# Altium schematic sheet FrontEnd.SchDoc: Title
size 420 x 297 mm; CheckedBy: -; CompanyName: CERN; DrawnBy: DrawnBy; Organization: CERN; Address1: European Organization for Nuclear Research; Address2: CH-1211 Genčve 23 - Switzerland; DocumentNumber: 2; Revision: -; SheetNumber: 2; SheetTotal: 10; EDA_Number: EDA-XXXXX-VX-X; Projet: -; ModifiedBy: -; CreateDate: XX/XX/XXXX; CheckedDate: -; Title2: Title2; DivGrp: TE/MPE; Designer: Designer; ModifiedDate: -
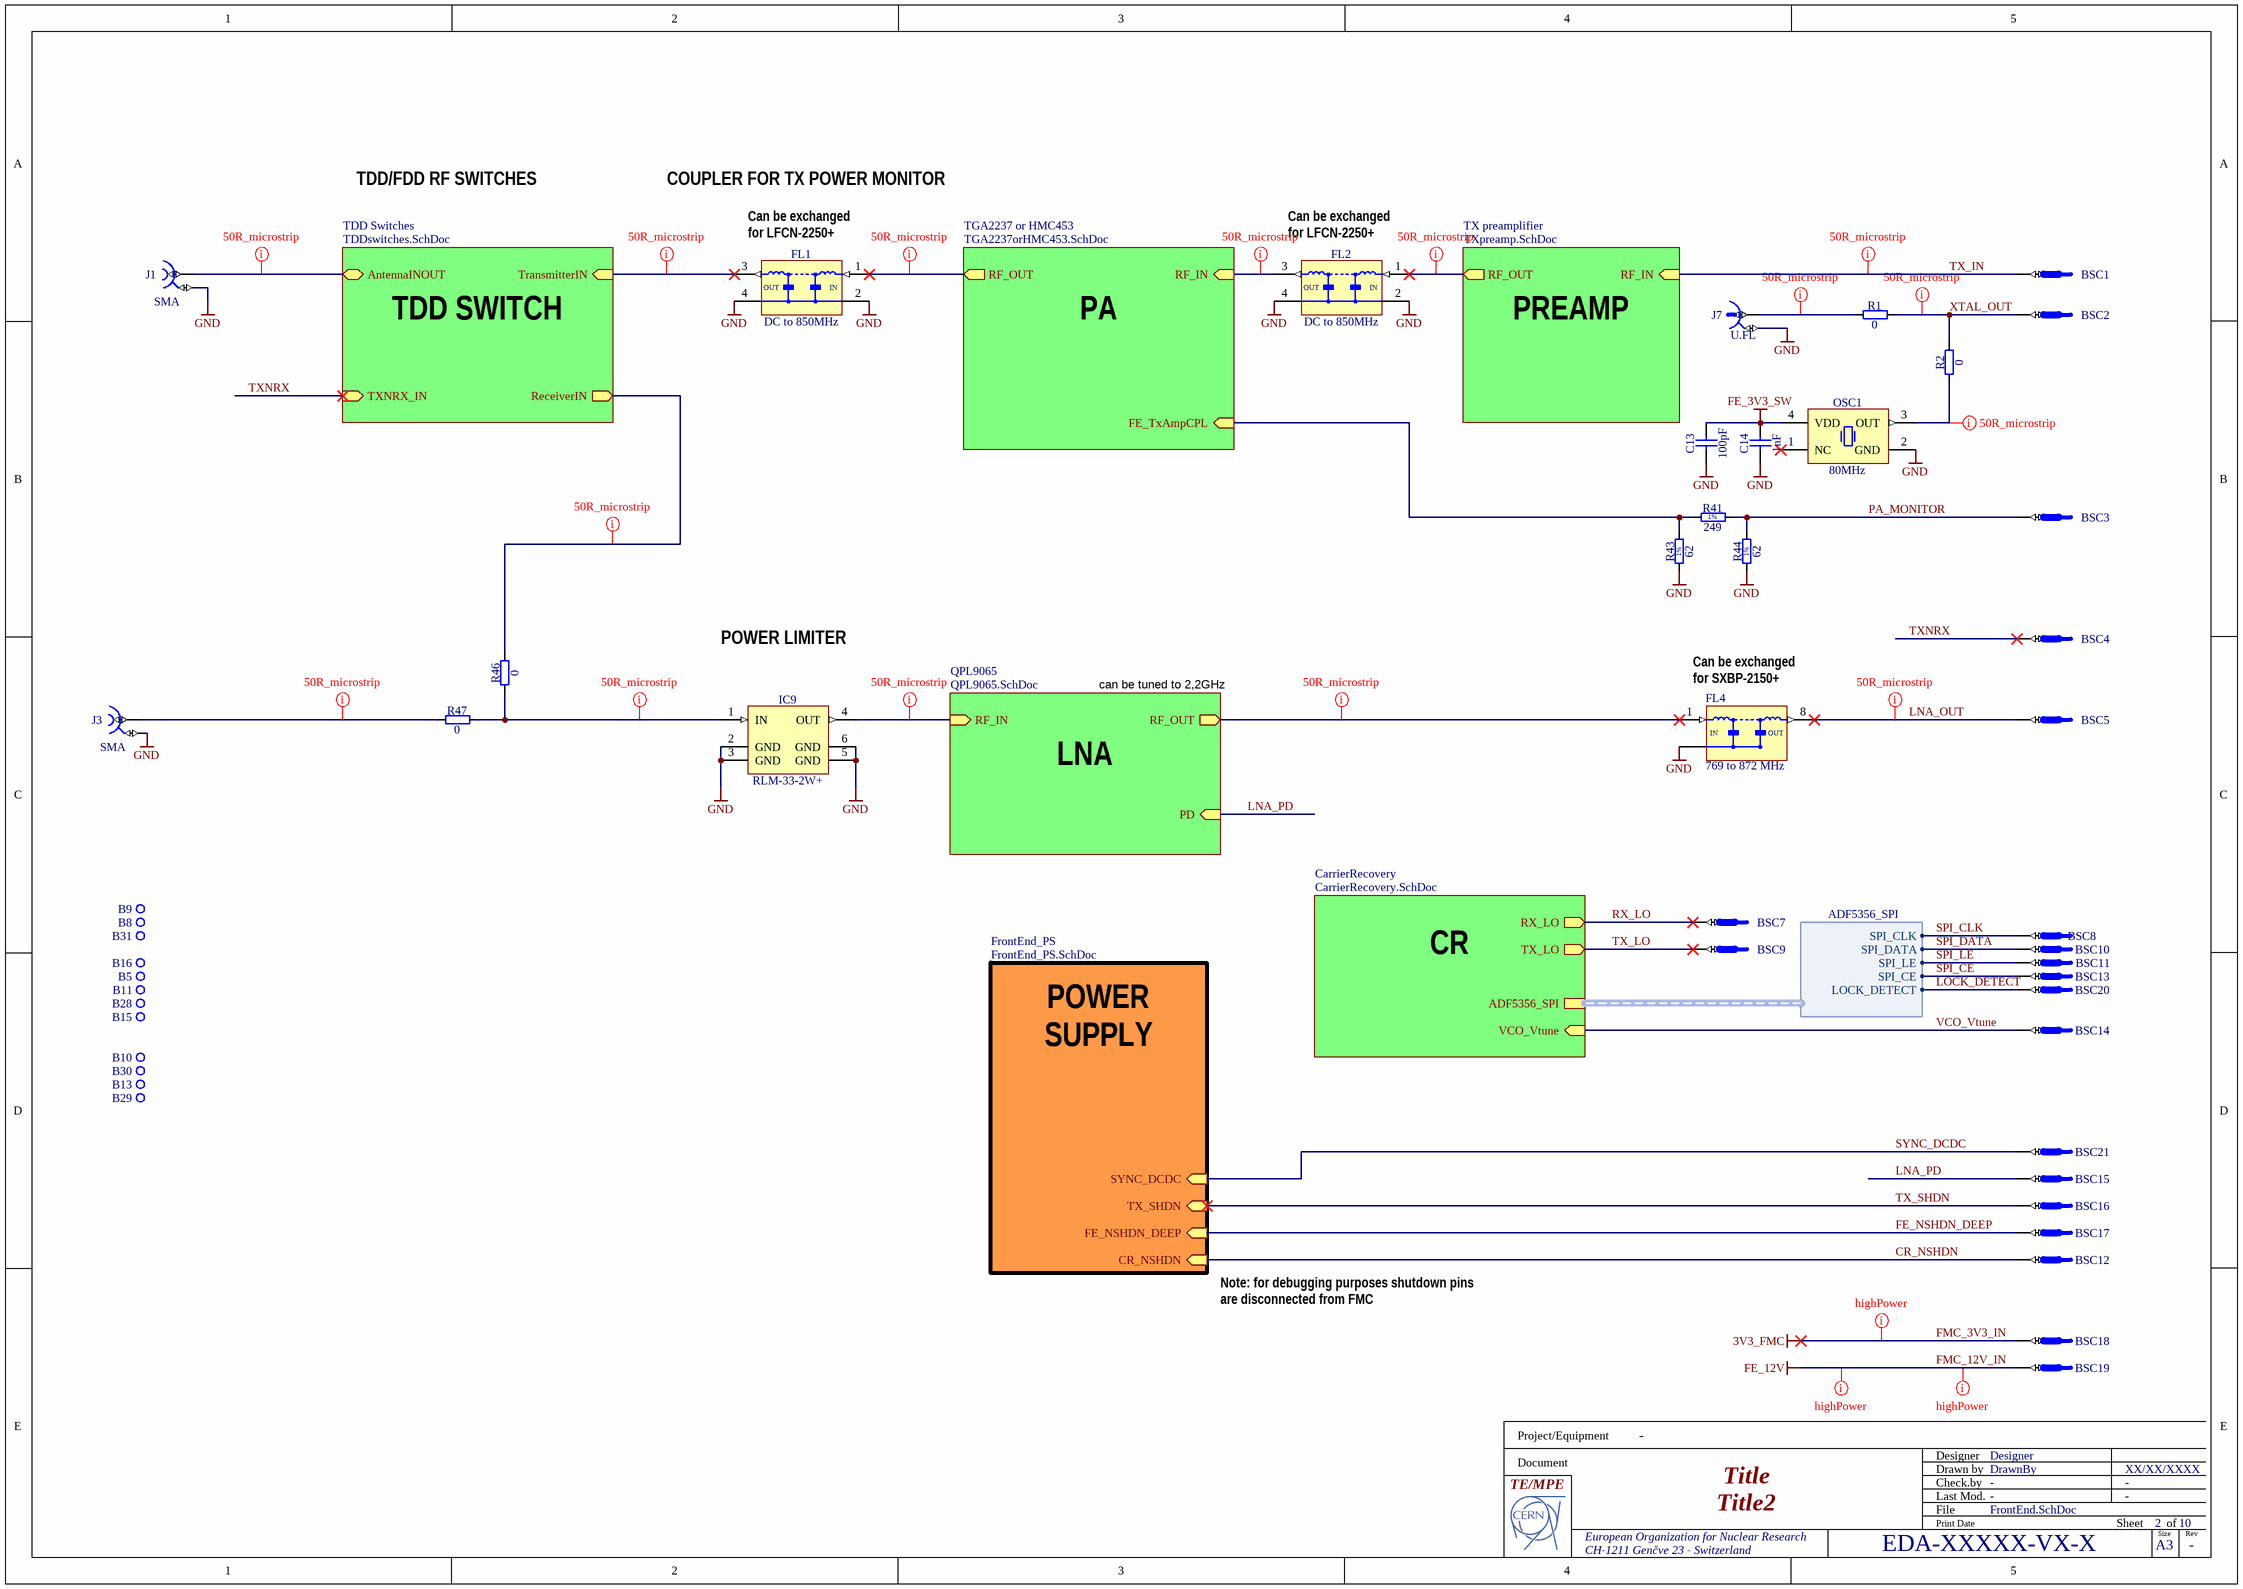
[diagram p0: FrontEnd.SchDoc]

## Parts
B5  Plated Hole  [MTG240_400]  (value not drawn)  (no BOM)
B8  Plated Hole  [MTG240_400]  (value not drawn)  (no BOM)
B9  Plated Hole  [MTG240_400]  (value not drawn)  (no BOM)
B10  Plated Hole  [MTG240_400]  (value not drawn)  (no BOM)
B11  Plated Hole  [MTG240_400]  (value not drawn)  (no BOM)
B13  Plated Hole  [MTG240_400]  (value not drawn)  (no BOM)
B15  Plated Hole  [MTG240_400]  (value not drawn)  (no BOM)
B16  Plated Hole  [MTG240_400]  (value not drawn)  (no BOM)
B28  Plated Hole  [MTG240_400]  (value not drawn)  (no BOM)
B29  Plated Hole  [MTG240_400]  (value not drawn)  (no BOM)
B30  Plated Hole  [MTG240_400]  (value not drawn)  (no BOM)
B31  Plated Hole  [MTG240_400]  (value not drawn)  (no BOM)
BSC1  06031206 Male  [PCB_CONN_0603M]  (value not drawn)
BSC2  06031206 Male  [PCB_CONN_0603M]  (value not drawn)
BSC3  06031206 Male  [PCB_CONN_0603M]  (value not drawn)
BSC4  06031206 Male  [PCB_CONN_0603M]  (value not drawn)
BSC5  06031206 Male  [PCB_CONN_0603M]  (value not drawn)
BSC7  06031206 Male  [PCB_CONN_0603M]  (value not drawn)
BSC8  06031206 Male  [PCB_CONN_0603M]  (value not drawn)
BSC9  06031206 Male  [PCB_CONN_0603M]  (value not drawn)
BSC10  06031206 Male  [PCB_CONN_0603M]  (value not drawn)
BSC11  06031206 Male  [PCB_CONN_0603M]  (value not drawn)
BSC12  06031206 Male  [PCB_CONN_0603M]  (value not drawn)
BSC13  06031206 Male  [PCB_CONN_0603M]  (value not drawn)
BSC14  06031206 Male  [PCB_CONN_0603M]  (value not drawn)
BSC15  06031206 Male  [PCB_CONN_0603M]  (value not drawn)
BSC16  06031206 Male  [PCB_CONN_0603M]  (value not drawn)
BSC17  06031206 Male  [PCB_CONN_0603M]  (value not drawn)
BSC18  1206 Male  [PCB_CONN_1206M]  (value not drawn)
BSC19  1206 Male  [PCB_CONN_1206M]  (value not drawn)
BSC20  06031206 Male  [PCB_CONN_0603M]  (value not drawn)
BSC21  06031206 Male  [PCB_CONN_0603M]  (value not drawn)
C13  100pF  [CAPC1005X55N]
C14  1nF  [CAPC1005X55N]
FL1  DC to 850MHz  [FIL_MINI-CIRCUITS_FV1206]
FL2  DC to 850MHz  [FIL_MINI-CIRCUITS_FV1206]
FL4  769 to 872 MHz  [SXBP-820+]
IC9  RLM-33-2W+  [MINI-CIRCUITS_TT1224]
J1  SMA  [TELEGARTNER_J01151A0451]
J3  SMA  [TELEGARTNER_J01151A0451]
J7  U.FL  [HIROSE_U.FL-R-SMT-1(10)]
OSC1  80MHz  [OSC_CRYSTEK_CCHD-575]
R1  0  [RESC1005X40N]
R2  0  [RESC1005X40N]
R41  249  [RESC1005X40N]
R43  62  [RESC1005X40N]
R44  62  [RESC1005X40N]
R46  0  [RESC1005X40N]
R47  0  [RESC1005X40N]

## Sub-sheets
CarrierRecovery = CarrierRecovery.SchDoc: RX_LO (out), TX_LO (out), ADF5356_SPI (harness ADF5356_SPI), VCO_Vtune (in)
FrontEnd_PS = FrontEnd_PS.SchDoc: TX_SHDN (in), FE_NSHDN_DEEP (in), CR_NSHDN (in), SYNC_DCDC (in)
QPL9065 = QPL9065.SchDoc: RF_OUT (out), RF_IN (in), PD (in)
TDD Switches = TDDswitches.SchDoc: AntennaINOUT (bidir), TransmitterIN (in), TXNRX_IN (in), ReceiverIN (out)
TGA2237 or HMC453 = TGA2237orHMC453.SchDoc: RF_OUT (out), RF_IN (in), FE_TxAmpCPL (in)
TX preamplifier = TXpreamp.SchDoc: RF_OUT (out), RF_IN (in)

## Harnesses
ADF5356_SPI: SPI_CLK, SPI_DATA, SPI_LE, SPI_CE, LOCK_DETECT

## Nets
FE_3V3_SW: C13.2 C14.2 OSC1.4(VDD)
FMC_3V3_IN: BSC18.1  [also labelled 3V3_FMC]
FMC_12V_IN: BSC19.1  [also labelled FE_12V]
GND: C13.1 C14.1 FL1.2(GND) FL1.4(GND) FL2.2(GND) FL2.4(GND) FL4.2,3,4,5,6,7(GND) IC9.2(GND) IC9.3(GND) IC9.5(GND) IC9.6(GND) J1.2 J3.2 J7.2 OSC1.2(GND) R43.1 R44.1
CR_NSHDN: BSC12.1 ; sheet FrontEnd_PS/CR_NSHDN
FE_NSHDN_DEEP: BSC17.1 ; sheet FrontEnd_PS/FE_NSHDN_DEEP
LNA_OUT: BSC5.1 FL4.8(RFOUT)
LNA_PD: BSC15.1 ; sheet QPL9065/PD
LOCK_DETECT: BSC20.1 ; sheet CarrierRecovery/ADF5356_SPI.LOCK_DETECT
PA_MONITOR: BSC3.1 R41.2 R44.2
RX_LO: BSC7.1 ; sheet CarrierRecovery/RX_LO
SPI_CE: BSC13.1 ; sheet CarrierRecovery/ADF5356_SPI.SPI_CE
SPI_CLK: BSC8.1 ; sheet CarrierRecovery/ADF5356_SPI.SPI_CLK
SPI_DATA: BSC10.1 ; sheet CarrierRecovery/ADF5356_SPI.SPI_DATA
SPI_LE: BSC11.1 ; sheet CarrierRecovery/ADF5356_SPI.SPI_LE
SYNC_DCDC: BSC21.1 ; sheet FrontEnd_PS/SYNC_DCDC
TX_IN: BSC1.1 ; sheet TX preamplifier/RF_IN
TX_LO: BSC9.1 ; sheet CarrierRecovery/TX_LO
TX_SHDN: BSC16.1 ; sheet FrontEnd_PS/TX_SHDN
TXNRX: BSC4.1 ; sheet TDD Switches/TXNRX_IN
VCO_Vtune: BSC14.1 ; sheet CarrierRecovery/VCO_Vtune
XTAL_OUT: BSC2.1 R1.2 R2.2
NetFL1_1: FL1.1(RFIN) ; sheet TGA2237 or HMC453/RF_OUT
NetFL1_3: FL1.3(RFOUT) ; sheet TDD Switches/TransmitterIN
NetFL2_1: FL2.1(RFIN) ; sheet TX preamplifier/RF_OUT
NetFL2_3: FL2.3(RFOUT) ; sheet TGA2237 or HMC453/RF_IN
NetFL4_1: FL4.1(RFIN) ; sheet QPL9065/RF_OUT
NetIC9_1: IC9.1(IN) R46.1 R47.2
NetIC9_4: IC9.4(OUT) ; sheet QPL9065/RF_IN
NetJ1_1: J1.1 ; sheet TDD Switches/AntennaINOUT
NetJ3_1: J3.1 R47.1
NetJ7_1: J7.1 R1.1
NetOSC1_3: OSC1.3(OUT) R2.1
NetR41_1: R41.1 R43.2 ; sheet TGA2237 or HMC453/FE_TxAmpCPL
NetR46_2: R46.2 ; sheet TDD Switches/ReceiverIN

Not connected (* = marked no-connect by the designer): B5 1; B8 1; B9 1; B10 1; B11 1; B13 1; B15 1; B16 1; B28 1; B29 1; B30 1; B31 1; OSC1 1(NC)*

## Layout directives
net class 50R_class: LNA_OUT, NetFL1_1, NetFL1_3, NetFL2_1, NetFL2_3, NetFL4_1, NetIC9_1, NetIC9_4, NetJ1_1, NetJ3_1, NetJ7_1, NetOSC1_3, NetR46_2, TX_IN, XTAL_OUT
net class highPower: FMC_3V3_IN, FMC_12V_IN

## Notes on the sheet
- TDD/FDD RF SWITCHES
- COUPLER FOR TX POWER MONITOR
- (near FL1) Can be exchanged for LFCN-2250+
- (near FL2) Can be exchanged for LFCN-2250+
- TDD SWITCH
- PA
- PREAMP
- (near R41) -20dB
- POWER LIMITER
- can be tuned to 2,2GHz
- (near FL4) Can be exchanged for SXBP-2150+
- LNA
- CR
- POWER
  SUPPLY
- Note: for debugging purposes shutdown pins are disconnected from FMC
- Project/Equipment
- Document
- Designer
- Drawn by
- Check.by
- File
- Last Mod.
- Print Date
- Sheet
- Size
- A3
- of
- Rev
- (in symbol LFCN-900+) OUT; IN
- (in symbol R0402_62R_1%_0.0625W_100PPM) 1%
- (in symbol R0402_249R_1%_0.0625W_100PPM) 1%
- (in symbol SXBP-820+) IN; OUT

## Library data of the parts
B5 B8-B11 B13 B15 B16 B28-B31 = PLATED_HOLE2.4_PAD4.0: Single Terminal Socket; Part Description: Plated Through Hole: Hole Dia.=2.4mm Pad Dia.=4.0mm; Mounted: No; Table: Pads; Part Number: PLATED_HOLE2.4_PAD4.0; Component Type: Standard (No BOM); Pin Count: 1; Family: Plated Hole; Socket: No; SMD: No; Status: None; ComponentHeight: 0mm; Author: CERN DEM JMW; CreateDate: 2011-10-10; LatestRevisionDate: 2011-10-10; PackageDescription: Plated Through Hole: Hole Dia.=2.4mm Pad Dia.=4.0mm
BSC1-BSC5 BSC7-BSC17 BSC20 BSC21 = 0603_male_BoardSolderConnector: Part Description: Board connection - soldered 0603 jumper; PressFit: No; Pin Count: 1; Socket: No; SMD: Yes; Sense: No; Status: None; System: Connector
BSC18 BSC19 = 1206_male_BoardSolderConnector: Part Description: Board connection - soldered 1206 jumper; PressFit: No; Pin Count: 1; Socket: No; SMD: Yes; Sense: No; Status: None; System: Connector
C13 = CC0402_100PF_50V_5%_C0G: Non-polarised capacitor; Part Description: SMD Multilayer Chip Ceramic Capacitor; Manufacturer: GENERIC; Manufacturer1 Part Number: C0402C101J5GACTU; Voltage: 50V; TC: C0G/NP0; Tolerance: ±5%; Part Number: CC0402_100PF_50V_5%_C0G; Component Kind: Standard; Component Type: Standard; Pin Count: 2; Value: 100pF; Status: Preferred; Manufacturer Part Number: CC0402_100PF_50V_5%_C0G; Case: 0402; Mounted: Yes; Socket: No; SMD: Yes; Sense: No; Manufacturer1 Example: KEMET; Manufacturer1 ComponentHeight: 0.55mm; HelpURL: \\cern.ch\dfs\Applications\Altium\Datasheets\CC0805_C0G_KEMET_(Commercial Grade).pdf; Author: CERN DEM JLC; CreateDate: 03.12.2007; LatestRevisionDate: 22.04.2015
C14 = CC0402_1NF_50V_10%_X7R: Non-polarised capacitor; Part Description: SMD Multilayer Chip Ceramic Capacitor; Manufacturer: GENERIC; Manufacturer1 Part Number: 223858715623; Voltage: 50V; TC: X7R; Tolerance: ±10%; Part Number: CC0402_1NF_50V_10%_X7R; Component Kind: Standard; Component Type: Standard; Pin Count: 2; Value: 1nF; Status: Not Recommended; Manufacturer Part Number: CC0402_1NF_50V_10%_X7R; Case: 0402; Mounted: Yes; Socket: No; SMD: Yes; Sense: No; Manufacturer1 Example: PHYCOMP; Manufacturer1 ComponentHeight: 0.55mm; HelpURL: \\cern.ch\dfs\Applications\Altium\Datasheets\CC0402_X7R_PHYCOMP.pdf; Author: CERN DEM JLC; CreateDate: 03.12.2007; LatestRevisionDate: 03.12.2007
FL1 FL2 = LFCN-900+: LTCC Low Pass Filter, DC -850 MHz; Part Number: FIL_MINI-CIRCUITS_LFCN-1575+; Part Description: 50 Ohm Low Pass Filter; Manufacturer: MINI-CIRCUITS; Manufacturer Part Number: LFCN-1575+; Value: DC to 1575MHz; Component Kind: Standard; Component Type: Standard; Pin Count: 2; Status: None; Mounted: Yes; Socket: No; SMD: Yes; Sense: No; ComponentHeight: 0.94mm; HelpURL: \\cern.ch\dfs\Applications\Altium\Datasheets\FIL_MINI-CIRCUITS_LFCN-1575+.pdf; Author: CERN DEM JLC; CreateDate: 21.04.2014; LatestRevisionDate: 21.04.2015
FL4 = SXBP-820+
IC9 = RLM-33-2W+: 50 Ohm, 0.2 to 3000MHz, +12 to +33dBm Limiter; Part Description: 50 Ohms, 0.2 to 3000MHz, +12 to +33dBm Limiter; Manufacturer: MINI-CIRCUITS; PressFit: No; Bonding: No; Part Number: RLM-33-2W+; Component Kind: Standard; Component Type: Standard; Device: RLM-33-2W+; PackageDescription: MINI-CIRCUITS TT1224 Case, 6 pin, 6.35mm W X 7.87mm L; Manufacturer Part Number: RLM-33-2W+; Pin Count: 6; Mounted: Yes; Socket: No; SMD: Yes; Sense: No; ComponentHeight: 4.06mm; Author: CERN DEM JLC; HelpURL: \\cern.ch\dfs\Applications\Altium\Datasheets\RLM-33-2W+.pdf; CreateDate: 11.09.2013; LatestRevisionDate: 11.09.2013
J1 J3 = TELEGARTNER_J01151A0451: Part Description: SMA 50 ohms Edge Mount Bulkhead Jack Receptacle; PressFit: No; Part Number: TELEGARTNER_J01151A0451; Component Kind: Standard; Component Type: Standard; Pin Count: 2; Family: SMA; Mounted: Yes; Socket: No; SMD: No; Sense: No; Status: None; Manufacturer: TELEGARTNER; Manufacturer Part Number: J01151A0451; ComponentHeight: 7mm; HelpURL: \\cern.ch\dfs\Applications\Altium\Datasheets\TELEGARTNER_J01151A0451.pdf; Author: CERN DEM JLC; CreateDate: 27/10/2016; LatestRevisionDate: 27/10/2016
J7 = HIROSE_U.FL-R-SMT-1(10): Part Description: Up to 6GHz Ultra Small Surface Mount Male Coaxial Connectors U.FL Series; Manufacturer: HIROSE (HRS); PressFit: No; Part Number: HIROSE_U.FL-R-SMT-1(10); Component Kind: Standard; Component Type: Standard; Pin Count: 2; Family: U.FL; Mounted: Yes; Socket: No; SMD: Yes; Sense: No; Status: None; Manufacturer Part Number: U.FL-R-SMT-1(10); ComponentHeight: 1.25mm; HelpURL: \\cern.ch\dfs\Applications\Altium\Datasheets\HIROSE_U.FL-R-SMT-1(10).pdf; Author: CERN DEM JLC; CreateDate: 24.03.2010; LatestRevisionDate: 24.03.2010
OSC1 = OSC_80MHZ_CRYSTEK_CCHD-575X-20: Oscillator 4 pins 1=NC 2=GND 3=OUT 4=VDD; Part Description: 3.3V, ±20ppm, 15pF, -40..85°C, LVCMOS/LVTTL/HCMOS Surface Mount Clock Oscillator (SiT5003 Series); Manufacturer: CRYSTEK CRYSTAL; Manufacturer Part Number: CCHD-575X-20-80.000; PressFit: No; Bonding: No; Part Number: OSC_80MHZ_CRYSTEK_CCHD-575X-20; Component Kind: Standard; Component Type: Standard; PackageDescription: Oscillator, 5.08mm Pitch; 4 Pin, 5.08mm L X 7.5mm W X 2.5mm H, CCHD-575 Serie; Value: 80MHz; Pin Count: 4; Mounted: Yes; Socket: No; SMD: Yes; Sense: No; ComponentHeight: 2.5mm; HelpURL: \\cern.ch\dfs\Applications\Altium\Datasheets\OSC_CRYSTEK_CCHD-575.pdf; Author: CERN DEM JLC; CreateDate: 22.09.2011; LatestRevisionDate: 09.10.2012
R1 R2 R46 R47 = R0402_0R_JUMPER: Resistor; Part Description: 1A (0.05R Max DC Resistance) Zero Ohm Jumper; Manufacturer: GENERIC; Manufacturer1 Part Number: 232270591001L; PressFit: No; Part Number: R0402_0R_JUMPER; Component Kind: Standard; Component Type: Standard; Pin Count: 2; Value: 0; Status: Not Recommended; Manufacturer Part Number: R0402_0R_JUMPER; Case: 0402; Mounted: Yes; Sense: No; Socket: No; SMD: Yes; Manufacturer1 Example: YAGEO PHYCOMP; Manufacturer1 ComponentHeight: 0.4mm; HelpURL: \\cern.ch\dfs\Applications\Altium\Datasheets\R0402_Phycomp_RC0402.pdf; Author: CERN DEM JLC; CreateDate: 03.12.2007; LatestRevisionDate: 17.10.2012
R41 = R0402_249R_1%_0.0625W_100PPM: Resistor - 1%; Part Description: General Purpose Thick Film Chip Resistor; Manufacturer: GENERIC; Manufacturer1 Part Number: CRCW0402249RFKED; TC: ±100ppm/°C; PressFit: No; Part Number: R0402_249R_1%_0.0625W_100PPM; Component Kind: Standard; Component Type: Standard; Pin Count: 2; Value: 249; Status: None; Power: 0.0625W; Tolerance: ±1%; Manufacturer Part Number: R0402_249R_1%_0.0625W_100PPM; Case: 0402; Mounted: Yes; Sense: No; Socket: No; SMD: Yes; Manufacturer1 Example: VISHAY; Manufacturer1 ComponentHeight: 0.4mm; HelpURL: \\cern.ch\dfs\Applications\Altium\Datasheets\R0402_VISHAY_CRCW e3.pdf; Author: CERN DEM JLC; CreateDate: 04.11.2014; LatestRevisionDate: 04.11.2014
R43 R44 = R0402_62R_1%_0.0625W_100PPM: Resistor - 1%; Part Description: General Purpose Thick Film Chip Resistor; Manufacturer: GENERIC; Manufacturer1 Part Number: 232270676209L; TC: ±100ppm/°C; PressFit: No; Part Number: R0402_62R_1%_0.0625W_100PPM; Component Kind: Standard; Component Type: Standard; Pin Count: 2; Value: 62; Status: Not Recommended; Power: 0.0625W; Tolerance: ±1%; Manufacturer Part Number: R0402_62R_1%_0.0625W_100PPM; Case: 0402; Mounted: Yes; Sense: No; Socket: No; SMD: Yes; Manufacturer1 Example: YAGEO PHYCOMP; Manufacturer1 ComponentHeight: 0.4mm; HelpURL: \\cern.ch\dfs\Applications\Altium\Datasheets\R0402_Phycomp_RC0402.pdf; Author: CERN DEM JLC; CreateDate: 03.12.2007; LatestRevisionDate: 17.10.2012